# EAGLE design MotherboardV2.0.2 (EAGLE 7.2.0)

## Sheet 1 of 8: LATCHING CIRCUIT
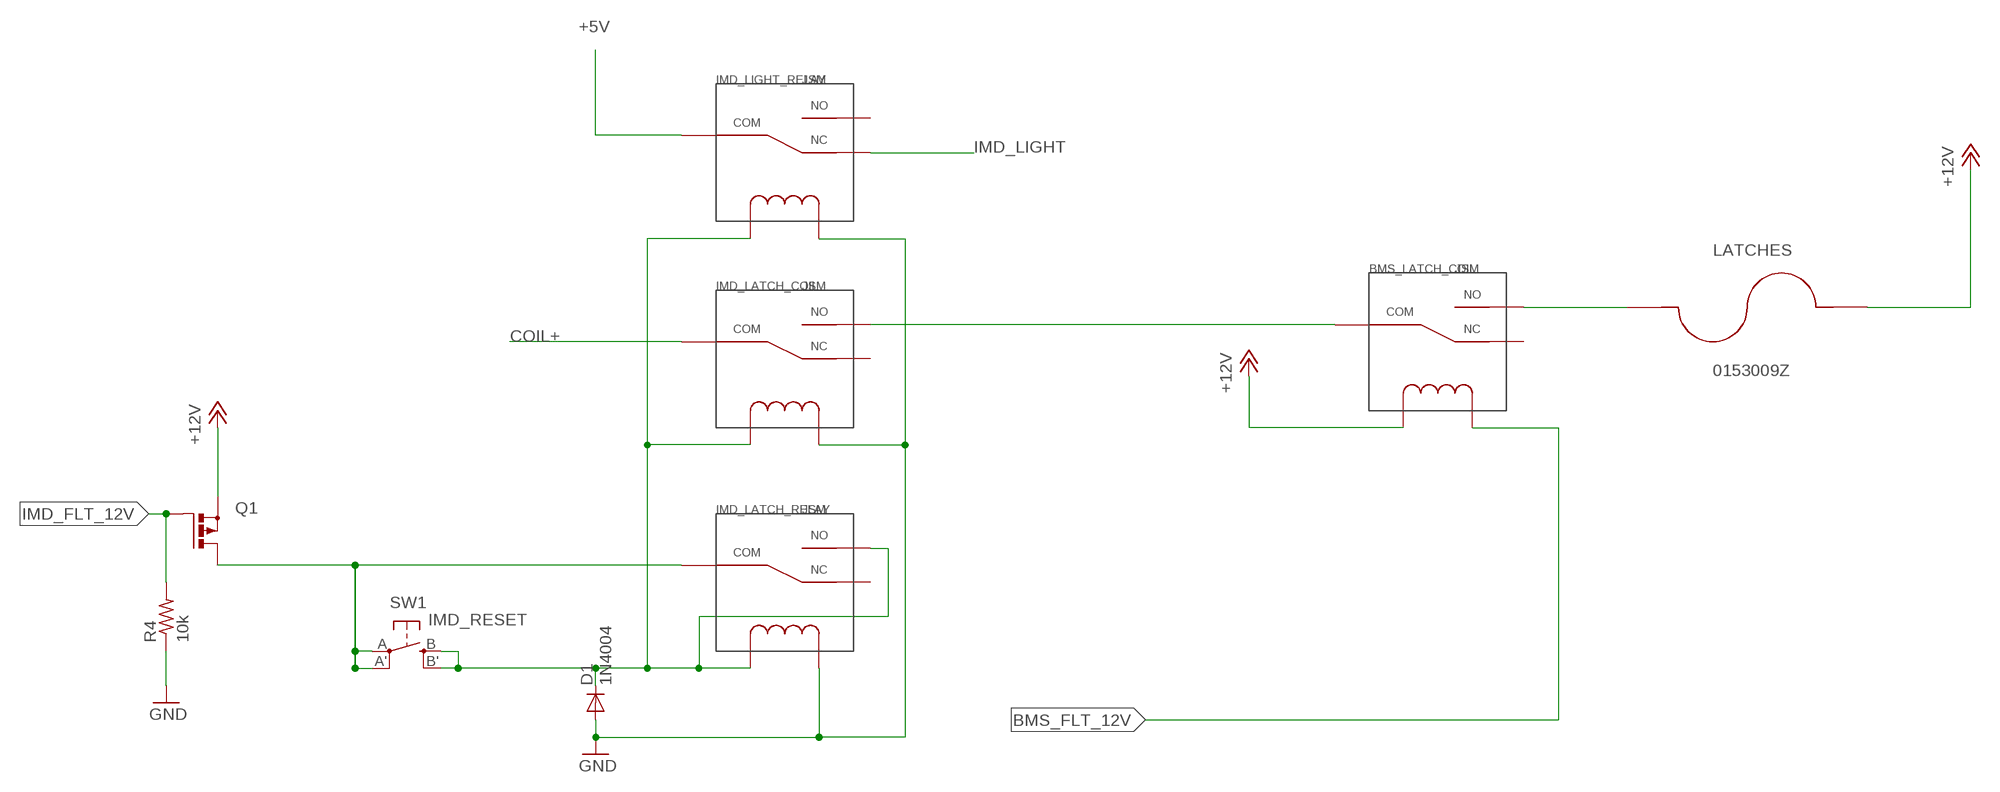
[diagram p0: schematic, sheet 1]

### Parts
BMS_LATCH_COIL  JSM  [JS-M]
D1  1N4004  [DO41-10]
IMD_LATCH_COIL  JSM  [JS-M]
IMD_LATCH_RELAY  JSM  [JS-M]
IMD_LIGHT_RELAY  JSM  [JS-M]
LATCHES  0153009Z  [MINIFUSEHOLDER]
Q1  PMOSFET_PTO220BV  [TO220BV]
R4  10k  R-US_0207/9  [0207/9]
SW1  IMD_RESET  SPST_TACT-EVQQ2  [EVQ-Q2]

### Nets
+5V: IMD_LIGHT_RELAY.COM ; also sheet 2,5,6,7
+12V: BMS_LATCH_COIL.COIL1 LATCHES.P$2 Q1.S ; also sheet 2,3,4,6,7
BMS_FLT_12V: BMS_LATCH_COIL.COIL2 ; also sheet 4,7
COIL+: IMD_LATCH_COIL.COM ; also sheet 2
GND: D1.A IMD_LATCH_COIL.COIL2 IMD_LATCH_RELAY.COIL2 IMD_LIGHT_RELAY.COIL2 R4.1 ; also sheet 2,3,4,5,6,7
IMD_FLT_12V: Q1.G R4.2 ; also sheet 2,7
IMD_LATCH_SW1: IMD_LATCH_RELAY.COM Q1.D SW1.A'(P1) SW1.A(P)
IMD_LATCH_SW2: D1.C IMD_LATCH_COIL.COIL1 IMD_LATCH_RELAY.COIL1 IMD_LATCH_RELAY.NO IMD_LIGHT_RELAY.COIL1 SW1.B'(S1) SW1.B(S)
IMD_LIGHT: IMD_LIGHT_RELAY.NC ; also sheet 2
N$11: BMS_LATCH_COIL.COM IMD_LATCH_COIL.NO
N$35: BMS_LATCH_COIL.NO LATCHES.P$1
Unconnected: BMS_LATCH_COIL.NC IMD_LATCH_COIL.NC IMD_LATCH_RELAY.NC IMD_LIGHT_RELAY.NO

## Sheet 2 of 8: CONNECTORS
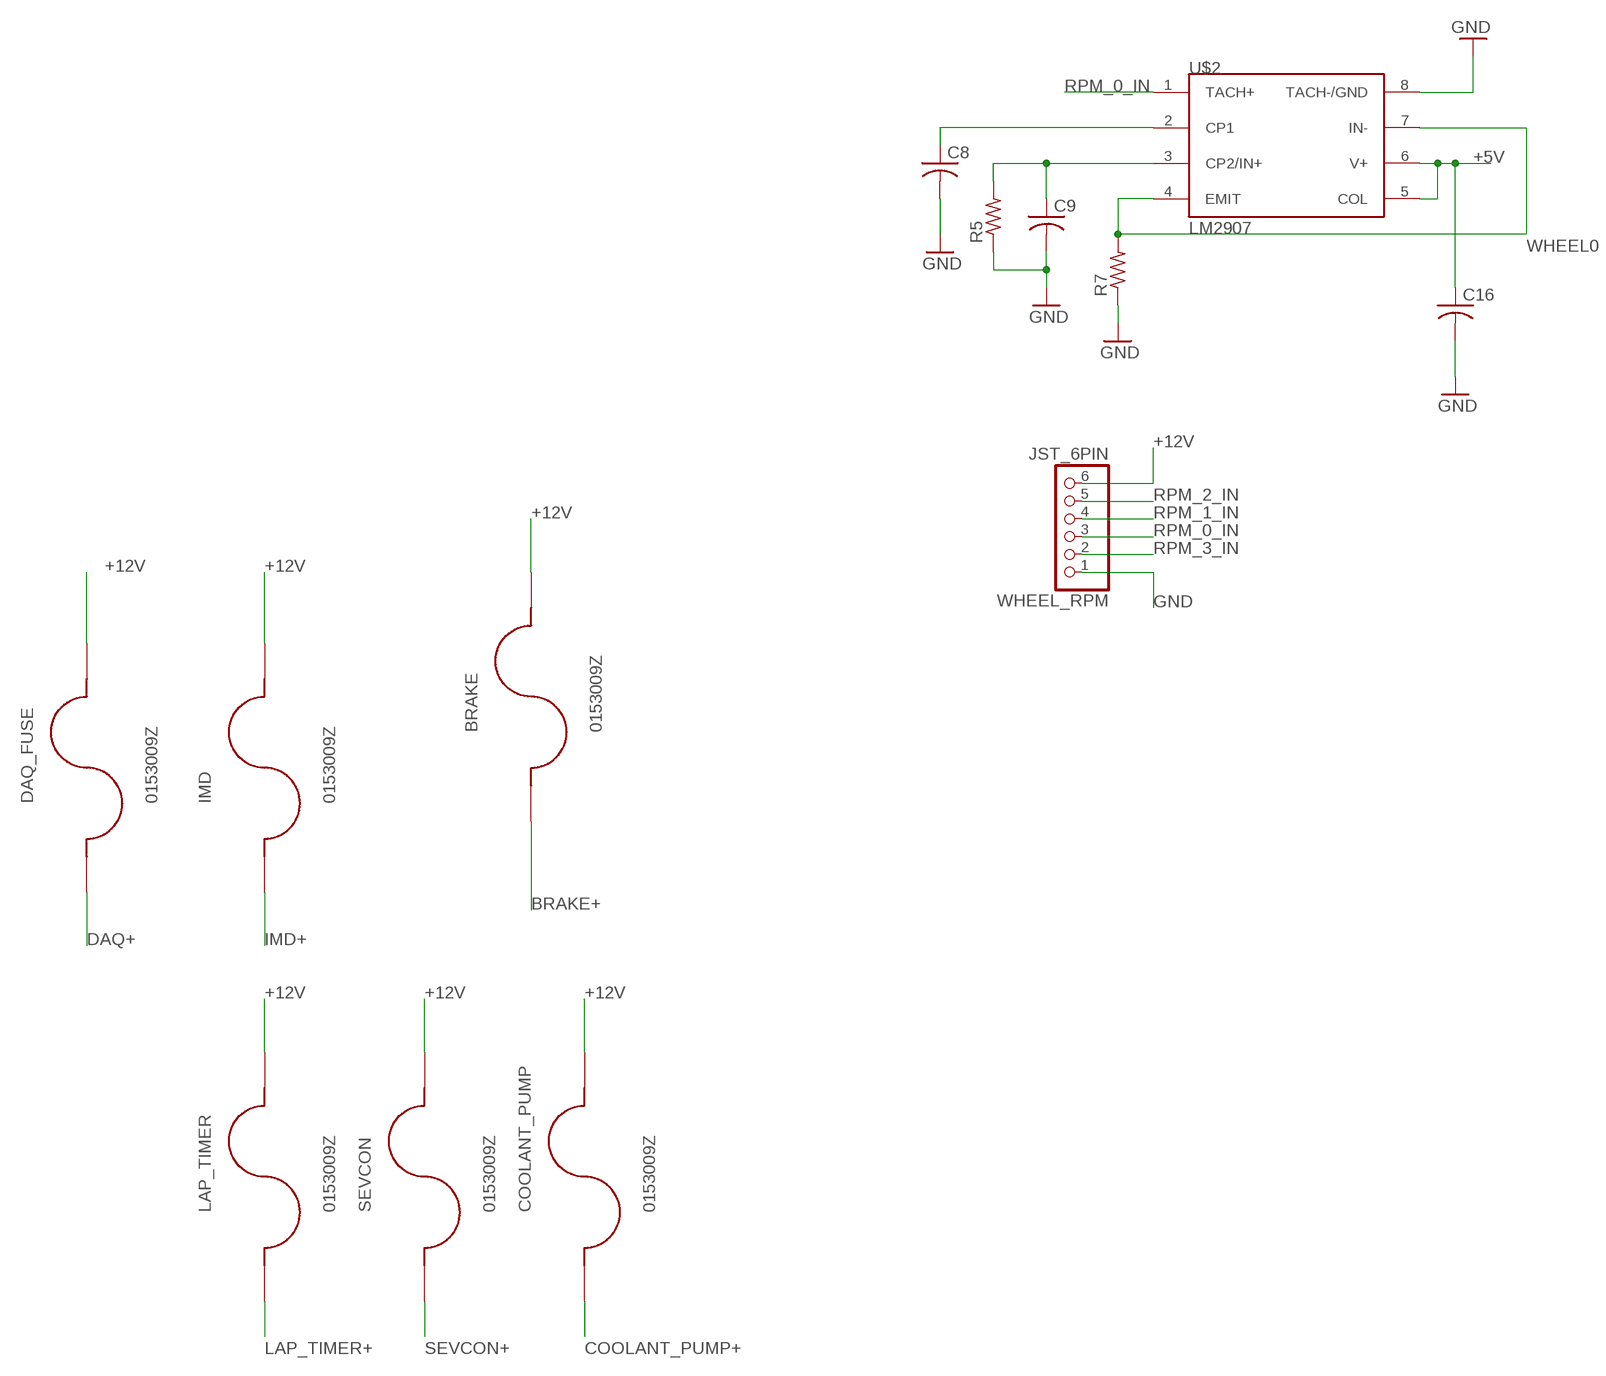
[diagram p1: schematic, sheet 2, part 1 of 2]
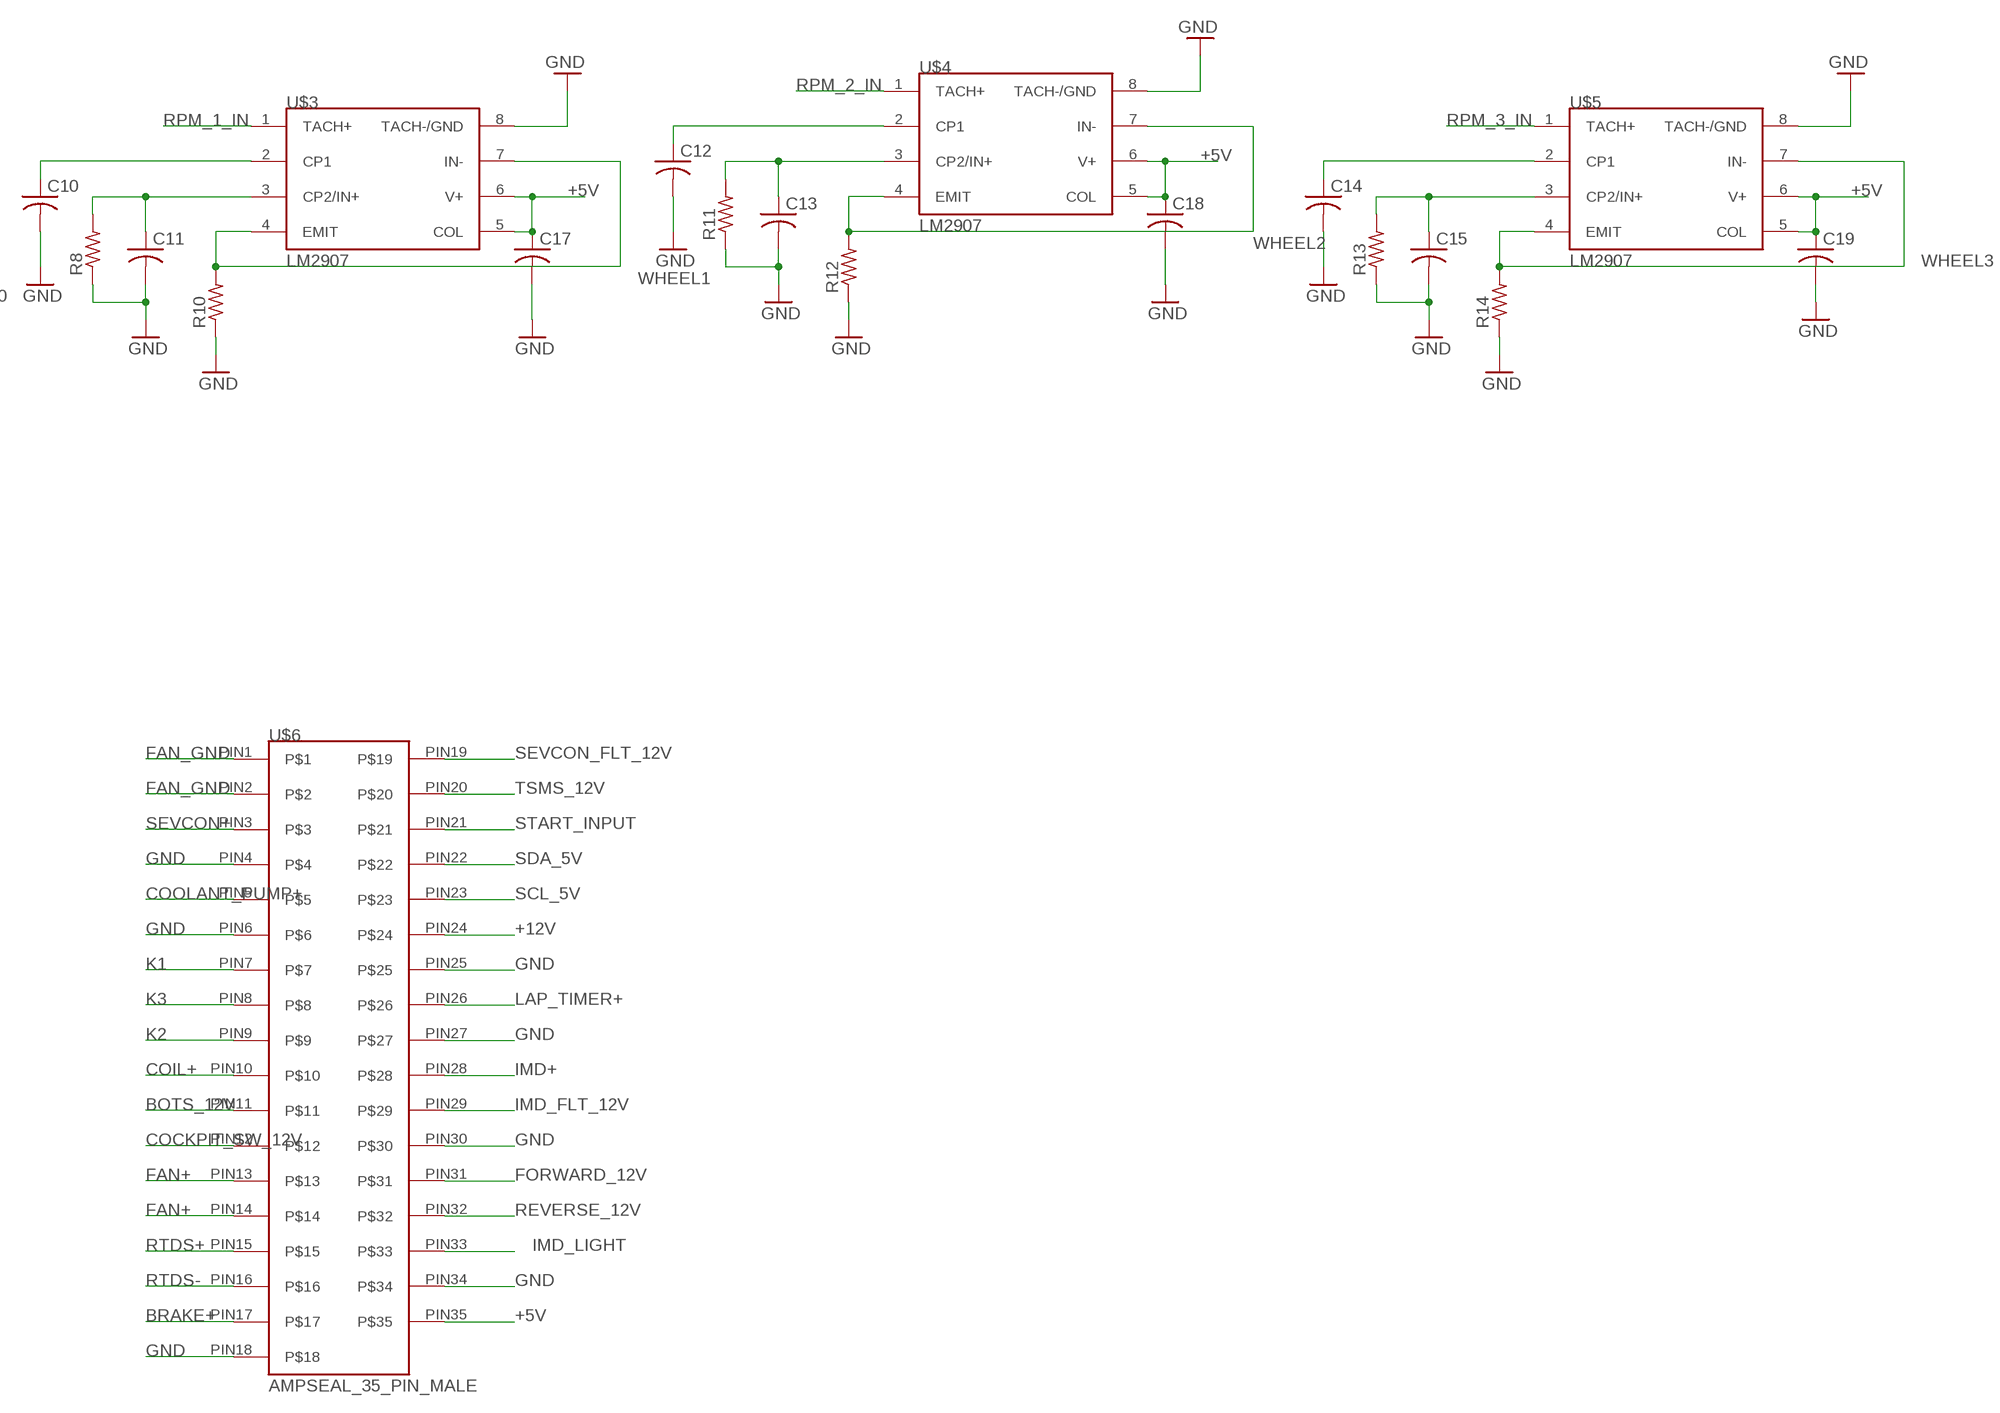
[diagram p2: schematic, sheet 2, part 2 of 2]

### Parts
BRAKE  0153009Z  [MINIFUSEHOLDER]
C8  C-US050-024X044  [C050-024X044]
C9  C-US050-024X044  [C050-024X044]
C10  C-US050-024X044  [C050-024X044]
C11  C-US050-024X044  [C050-024X044]
C12  C-US050-024X044  [C050-024X044]
C13  C-US050-024X044  [C050-024X044]
C14  C-US050-024X044  [C050-024X044]
C15  C-US050-024X044  [C050-024X044]
C16  C-US050-024X044  [C050-024X044]
C17  C-US050-024X044  [C050-024X044]
C18  C-US050-024X044  [C050-024X044]
C19  C-US050-024X044  [C050-024X044]
COOLANT_PUMP  0153009Z  [MINIFUSEHOLDER]
DAQ_FUSE  0153009Z  [MINIFUSEHOLDER]
IMD  0153009Z  [MINIFUSEHOLDER]
LAP_TIMER  0153009Z  [MINIFUSEHOLDER]
R5  R-US_0309/V  [0309V]
R7  R-US_0309/V  [0309V]
R8  R-US_0309/V  [0309V]
R10  R-US_0309/V  [0309V]
R11  R-US_0309/V  [0309V]
R12  R-US_0309/V  [0309V]
R13  R-US_0309/V  [0309V]
R14  R-US_0309/V  [0309V]
SEVCON  0153009Z  [MINIFUSEHOLDER]
U$2  LM2907  [DIL08]
U$3  LM2907  [DIL08]
U$4  LM2907  [DIL08]
U$5  LM2907  [DIL08]
U$6  AMPSEAL_35_PIN_MALE  [AMPSEAL_35_PIN_MALE]
WHEEL_RPM  JST_6PIN  [JST-PH-6-THM]

### Nets
+5V: C16.1 C17.1 C18.1 C19.1 U$2.5(COL) U$2.6(V+) U$3.5(COL) U$3.6(V+) U$4.5(COL) U$4.6(V+) U$5.5(COL) U$5.6(V+) U$6.PIN35 ; also sheet 1,5,6,7
+12V: BRAKE.P$2 COOLANT_PUMP.P$2 DAQ_FUSE.P$2 IMD.P$2 LAP_TIMER.P$2 SEVCON.P$2 U$6.PIN24 WHEEL_RPM.6 ; also sheet 1,3,4,6,7
BOTS_12V: U$6.PIN11 ; also sheet 7
BRAKE+: BRAKE.P$1 U$6.PIN17
COCKPIT_SW_12V: U$6.PIN12 ; also sheet 7
COIL+: U$6.PIN10 ; also sheet 1
COOLANT_PUMP+: COOLANT_PUMP.P$1 U$6.PIN5
DAQ+: DAQ_FUSE.P$1 ; also sheet 6
FAN+: U$6.PIN13 U$6.PIN14 ; also sheet 4
FAN_GND: U$6.PIN1 U$6.PIN2 ; also sheet 4
FORWARD_12V: U$6.PIN31 ; also sheet 7
GND: C8.2 C9.2 C10.2 C11.2 C12.2 C13.2 C14.2 C15.2 C16.2 C17.2 C18.2 C19.2 R5.1 R7.1 R8.1 R10.1 R11.1 R12.1 R13.1 R14.1 U$2.8(TACH-/GND) U$3.8(TACH-/GND) U$4.8(TACH-/GND) U$5.8(TACH-/GND) U$6.PIN4 U$6.PIN6 U$6.PIN18 U$6.PIN25 U$6.PIN27 U$6.PIN30 U$6.PIN34 WHEEL_RPM.1 ; also sheet 1,3,4,5,6,7
IMD+: IMD.P$1 U$6.PIN28
IMD_FLT_12V: U$6.PIN29 ; also sheet 1,7
IMD_LIGHT: U$6.PIN33 ; also sheet 1
K1: U$6.PIN7 ; also sheet 4
K2: U$6.PIN9 ; also sheet 4
K3: U$6.PIN8 ; also sheet 4
LAP_TIMER+: LAP_TIMER.P$1 U$6.PIN26
N$4: C8.1 U$2.2(CP1)
N$5: C9.1 R5.2 U$2.3(CP2/IN+)
N$8: C10.1 U$3.2(CP1)
N$9: C11.1 R8.2 U$3.3(CP2/IN+)
N$12: C12.1 U$4.2(CP1)
N$13: C13.1 R11.2 U$4.3(CP2/IN+)
N$15: C14.1 U$5.2(CP1)
N$16: C15.1 R13.2 U$5.3(CP2/IN+)
REVERSE_12V: U$6.PIN32 ; also sheet 7
RPM_0_IN: U$2.1(TACH+) WHEEL_RPM.3
RPM_1_IN: U$3.1(TACH+) WHEEL_RPM.4
RPM_2_IN: U$4.1(TACH+) WHEEL_RPM.5
RPM_3_IN: U$5.1(TACH+) WHEEL_RPM.2
RTDS+: U$6.PIN15 ; also sheet 3
RTDS-: U$6.PIN16 ; also sheet 3
SCL_5V: U$6.PIN23 ; also sheet 5
SDA_5V: U$6.PIN22 ; also sheet 5
SEVCON+: SEVCON.P$1 U$6.PIN3
SEVCON_FLT_12V: U$6.PIN19 ; also sheet 7
START_INPUT: U$6.PIN21 ; also sheet 5
TSMS_12V: U$6.PIN20 ; also sheet 7
WHEEL0: R7.2 U$2.4(EMIT) U$2.7(IN-) ; also sheet 5
WHEEL1: R10.2 U$3.4(EMIT) U$3.7(IN-) ; also sheet 5
WHEEL2: R12.2 U$4.4(EMIT) U$4.7(IN-) ; also sheet 5
WHEEL3: R14.2 U$5.4(EMIT) U$5.7(IN-) ; also sheet 5

## Sheet 3 of 8: OUTPUT RELAYS
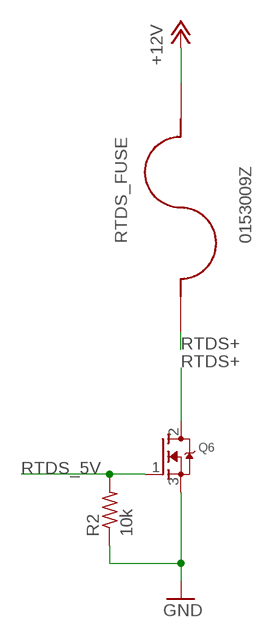
[diagram p3: schematic, sheet 3]

### Parts
Q6  MOSFET-NGDS_TO220V  [TO220V]
R2  10k  R-US_0207/9  [0207/9]
RTDS_FUSE  0153009Z  [MINIFUSEHOLDER]

### Nets
+12V: RTDS_FUSE.P$2 ; also sheet 1,2,4,6,7
GND: Q6.3(S) R2.1 ; also sheet 1,2,4,5,6,7
RTDS+: RTDS_FUSE.P$1 ; also sheet 2
RTDS-: Q6.2(D) ; also sheet 2
RTDS_5V: Q6.1(G) R2.2 ; also sheet 5

## Sheet 4 of 8: BMS CONNECTORS
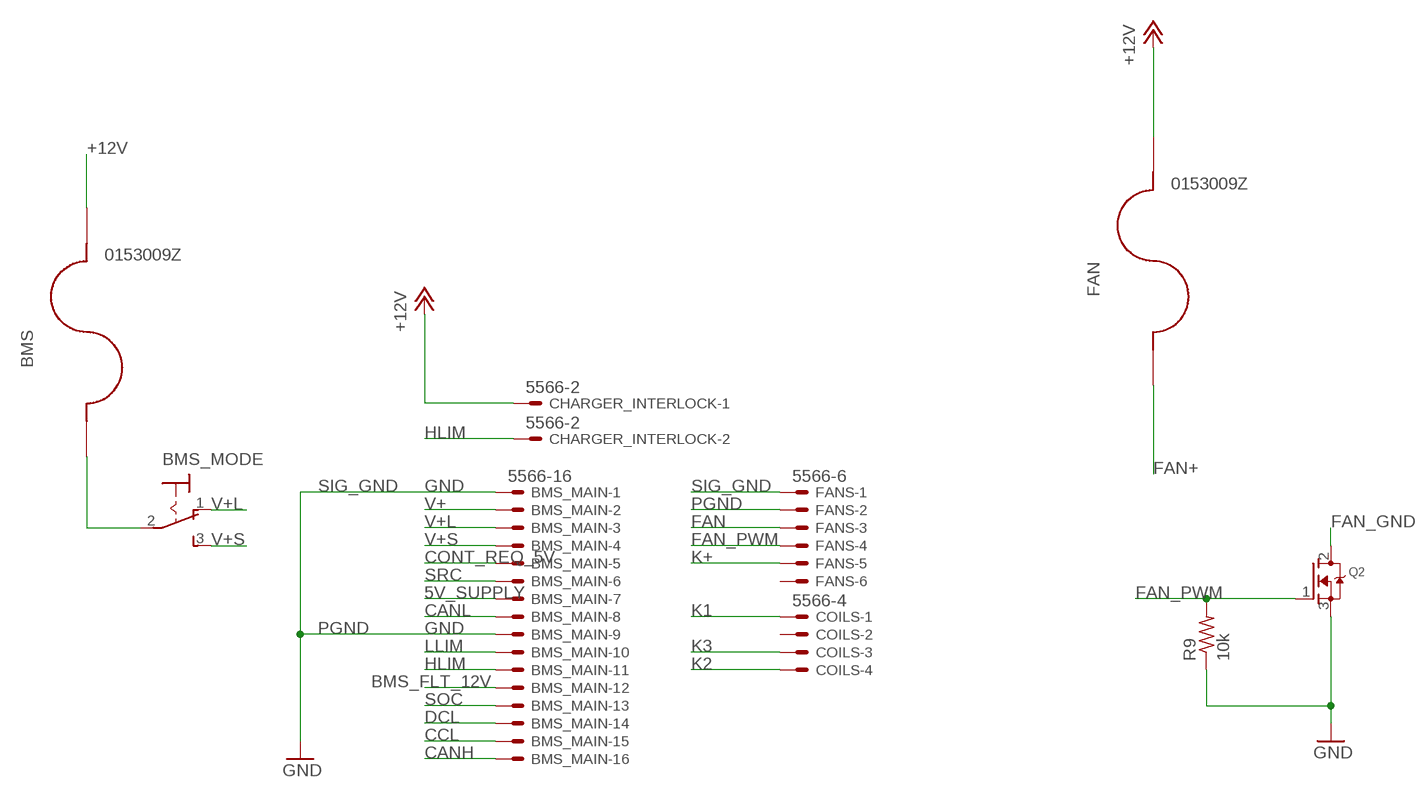
[diagram p4: schematic, sheet 4]

### Parts
BMS  0153009Z  [MINIFUSEHOLDER]
BMS_MAIN  5566-16  [5566-16]
BMS_MODE  320-916  [320-916]
CHARGER_INTERLOCK  5566-2  [5566-2]
COILS  5566-4  [5566-4]
FAN  0153009Z  [MINIFUSEHOLDER]
FANS  5566-6  [5566-6]
Q2  MOSFET-NGDS_TO220V  [TO220V]
R9  10k  R-US_0207/9  [0207/9]

### Nets
5V_SUPPLY: BMS_MAIN.7
+12V: BMS.P$2 CHARGER_INTERLOCK.1 FAN.P$2 ; also sheet 1,2,3,6,7
BMS_FLT_12V: BMS_MAIN.12 ; also sheet 1,7
CANH: BMS_MAIN.16
CANL: BMS_MAIN.8
CCL: BMS_MAIN.15
CONT_REQ_5V: BMS_MAIN.5 ; also sheet 5
DCL: BMS_MAIN.14
FAN: FANS.3
FAN+: FAN.P$1 ; also sheet 2
FAN_GND: Q2.2(D) ; also sheet 2
FAN_PWM: FANS.4 Q2.1(G) R9.2
GND: BMS_MAIN.1 BMS_MAIN.9 Q2.3(S) R9.1 ; also sheet 1,2,3,5,6,7
HLIM: BMS_MAIN.11 CHARGER_INTERLOCK.2
K1: COILS.1 ; also sheet 2
K2: COILS.4 ; also sheet 2
K3: COILS.3 ; also sheet 2
K+: FANS.5
LLIM: BMS_MAIN.10
N$3: BMS.P$1 BMS_MODE.2(P)
PGND: FANS.2
SIG_GND: FANS.1
SOC: BMS_MAIN.13 ; also sheet 5
SRC: BMS_MAIN.6
V+: BMS_MAIN.2
V+L: BMS_MAIN.3 BMS_MODE.1(O)
V+S: BMS_MAIN.4 BMS_MODE.3(S)
Unconnected: COILS.2 FANS.6

### Notes on the sheet
- SIG_GND
- PGND

## Sheet 5 of 8: VCU
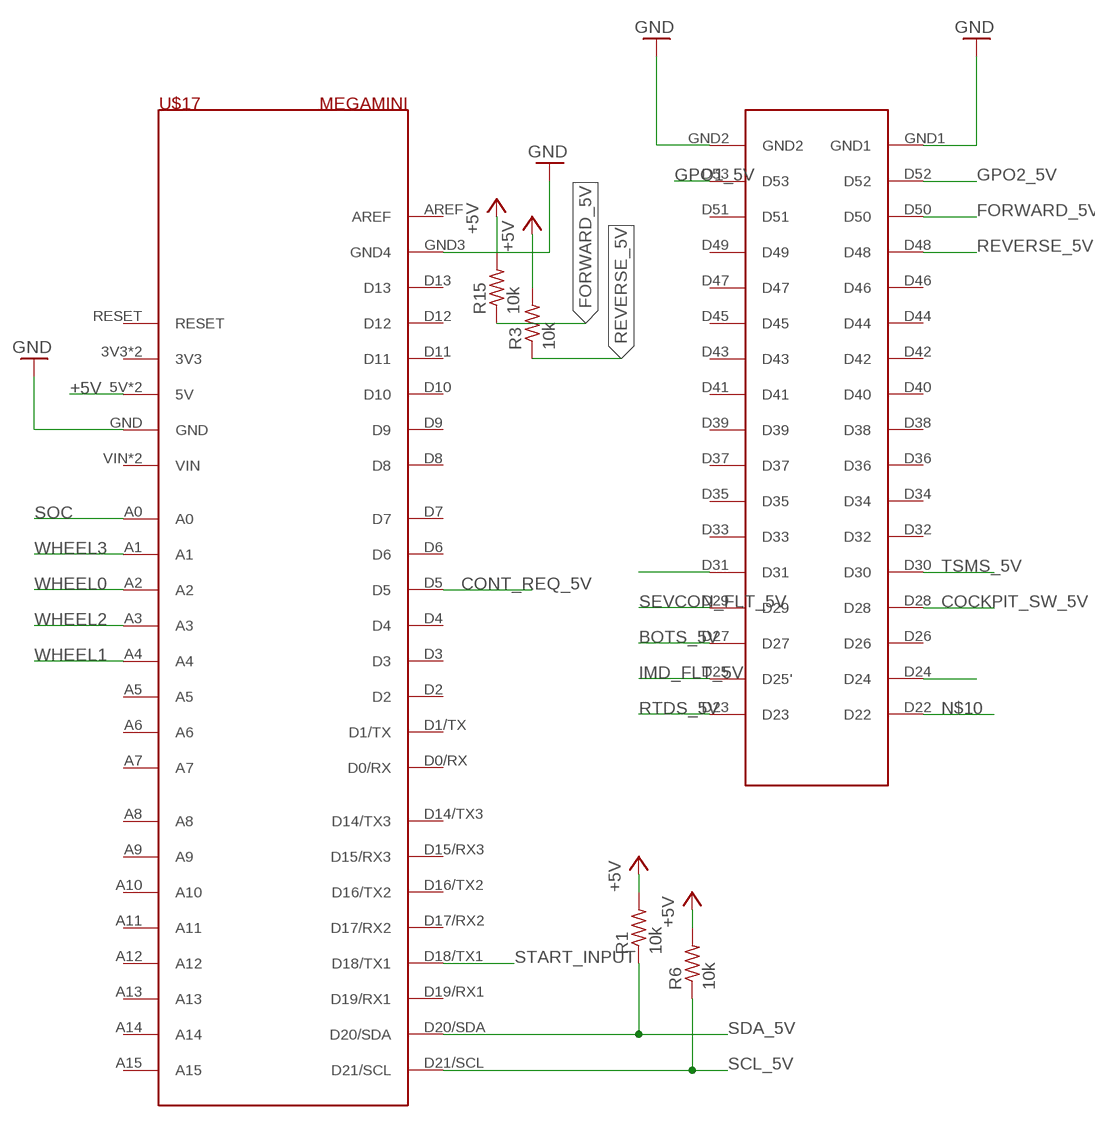
[diagram p5: schematic, sheet 5]

### Parts
R1  10k  R-US_0207/9  [0207/9]
R3  10k  R-US_0207/9  [0207/9]
R6  10k  R-US_0207/9  [0207/9]
R15  10k  R-US_0207/9  [0207/9]
U$17  MEGAMINI  [MEGAMINI]

### Nets
+5V: R1.2 R3.2 R6.2 R15.2 U$17.5V U$17.5V_2(5V) ; also sheet 1,2,6,7
BMS_FLT_5V: U$17.D31 ; also sheet 7
BOTS_5V: U$17.D27 ; also sheet 7
COCKPIT_SW_5V: U$17.D28 ; also sheet 7
CONT_REQ_5V: U$17.D5 ; also sheet 4
FORWARD_5V: R15.1 U$17.D50 ; also sheet 7
GND: U$17.GND U$17.GND1 U$17.GND2 U$17.GND3(GND4) ; also sheet 1,2,3,4,6,7
GPO1_5V: U$17.D53 ; also sheet 7
GPO2_5V: U$17.D52 ; also sheet 7
IMD_FLT_5V: U$17.D25(D25') ; also sheet 7
N$1: U$17.D24
N$10: U$17.D22
REVERSE_5V: R3.1 U$17.D48 ; also sheet 7
RTDS_5V: U$17.D23 ; also sheet 3
SCL_5V: R6.1 U$17.D21/SCL ; also sheet 2
SDA_5V: R1.1 U$17.D20/SDA ; also sheet 2
SEVCON_FLT_5V: U$17.D29 ; also sheet 7
SOC: U$17.A0 ; also sheet 4
START_INPUT: U$17.D18/TX1 ; also sheet 2
TSMS_5V: U$17.D30 ; also sheet 7
WHEEL0: U$17.A2 ; also sheet 2
WHEEL1: U$17.A4 ; also sheet 2
WHEEL2: U$17.A3 ; also sheet 2
WHEEL3: U$17.A1 ; also sheet 2
Unconnected: U$17.3V3 U$17.3V3_2(3V3) U$17.A5 U$17.A6 U$17.A7 U$17.A8 U$17.A9 U$17.A10 U$17.A11 U$17.A12 U$17.A13 U$17.A14 U$17.A15 U$17.AREF U$17.D0/RX U$17.D1/TX U$17.D2 U$17.D3 U$17.D4 U$17.D6 U$17.D7 U$17.D8 U$17.D9 U$17.D10 U$17.D11 U$17.D12 U$17.D13 U$17.D14/TX3 U$17.D15/RX3 U$17.D16/TX2 U$17.D17/RX2 U$17.D19/RX1 U$17.D26 U$17.D32 U$17.D33 U$17.D34 U$17.D35 U$17.D36 U$17.D37 U$17.D38 U$17.D39 U$17.D40 U$17.D41 U$17.D42 U$17.D43 U$17.D44 U$17.D45 U$17.D46 U$17.D47 U$17.D49 U$17.D51 U$17.RESET U$17.VIN U$17.VIN_2(VIN)

## Sheet 6 of 8: REGULATORS
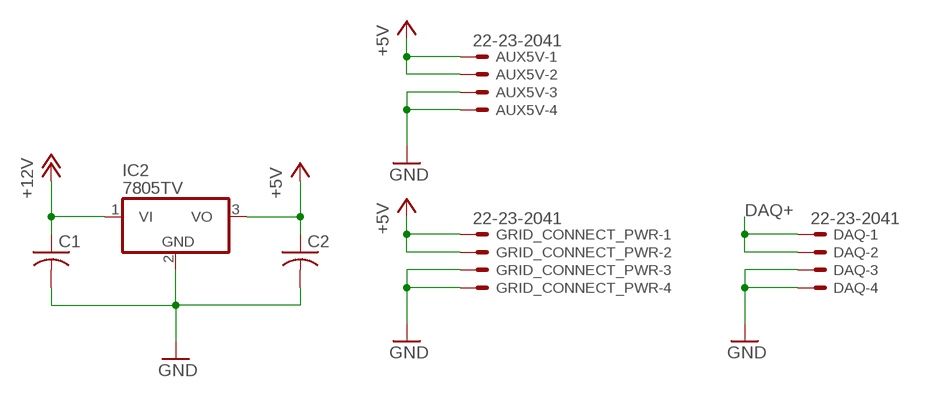
[diagram p6: schematic, sheet 6]

### Parts
AUX5V  22-23-2041  [22-23-2041]
C1  C-US050-024X044  [C050-024X044]
C2  C-US050-024X044  [C050-024X044]
DAQ  22-23-2041  [22-23-2041]
GRID_CONNECT_PWR  22-23-2041  [22-23-2041]
IC2  7805TV  [TO220V]

### Nets
+5V: AUX5V.1 AUX5V.2 C2.1 GRID_CONNECT_PWR.1 GRID_CONNECT_PWR.2 IC2.3(VO) ; also sheet 1,2,5,7
+12V: C1.1 IC2.1(VI) ; also sheet 1,2,3,4,7
DAQ+: DAQ.1 DAQ.2 ; also sheet 2
GND: AUX5V.3 AUX5V.4 C1.2 C2.2 DAQ.3 DAQ.4 GRID_CONNECT_PWR.3 GRID_CONNECT_PWR.4 IC2.2(GND) ; also sheet 1,2,3,4,5,7

## Sheet 7 of 8: LEVEL SHIFTING
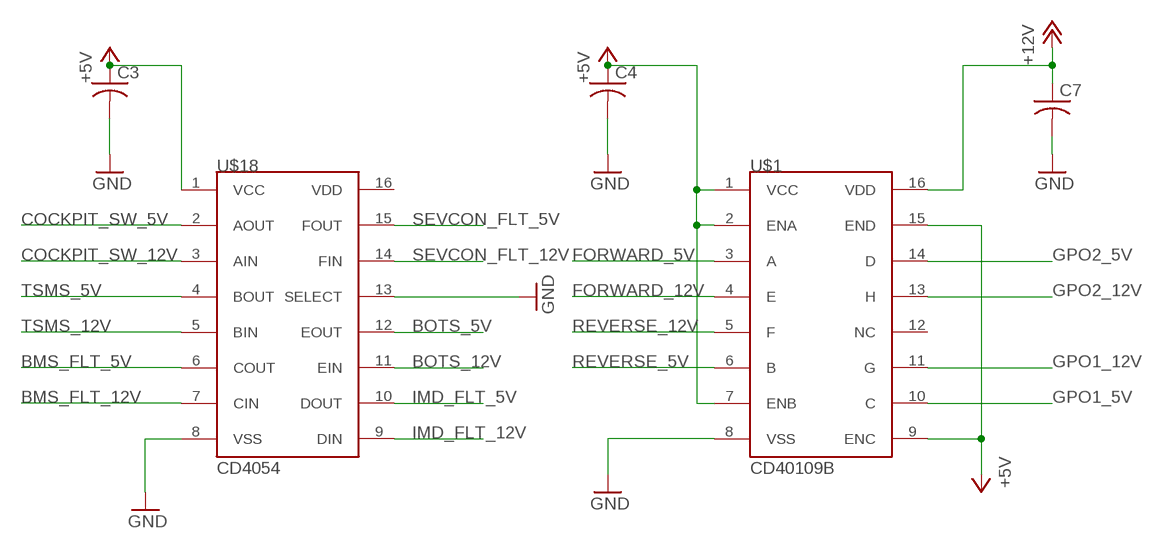
[diagram p7: schematic, sheet 7]

### Parts
C3  C-US050-024X044  [C050-024X044]
C4  C-US050-024X044  [C050-024X044]
C7  C-US050-024X044  [C050-024X044]
U$1  CD40109B  [DIL16]
U$18  CD4054  [DIL16]

### Nets
+5V: C3.1 C4.1 U$1.1(VCC) U$1.2(ENA) U$1.7(ENB) U$1.9(ENC) U$1.15(END) U$18.1(VCC) ; also sheet 1,2,5,6
+12V: C7.1 U$1.16(VDD) ; also sheet 1,2,3,4,6
BMS_FLT_5V: U$18.6(COUT) ; also sheet 5
BMS_FLT_12V: U$18.7(CIN) ; also sheet 1,4
BOTS_5V: U$18.12(EOUT) ; also sheet 5
BOTS_12V: U$18.11(EIN) ; also sheet 2
COCKPIT_SW_5V: U$18.2(AOUT) ; also sheet 5
COCKPIT_SW_12V: U$18.3(AIN) ; also sheet 2
FORWARD_5V: U$1.3(A) ; also sheet 5
FORWARD_12V: U$1.4(E) ; also sheet 2
GND: C3.2 C4.2 C7.2 U$1.8(VSS) U$18.8(VSS) U$18.13(SELECT) ; also sheet 1,2,3,4,5,6
GPO1_5V: U$1.10(C) ; also sheet 5
GPO1_12V: U$1.11(G)
GPO2_5V: U$1.14(D) ; also sheet 5
GPO2_12V: U$1.13(H)
IMD_FLT_5V: U$18.10(DOUT) ; also sheet 5
IMD_FLT_12V: U$18.9(DIN) ; also sheet 1,2
REVERSE_5V: U$1.6(B) ; also sheet 5
REVERSE_12V: U$1.5(F) ; also sheet 2
SEVCON_FLT_5V: U$18.15(FOUT) ; also sheet 5
SEVCON_FLT_12V: U$18.14(FIN) ; also sheet 2
TSMS_5V: U$18.4(BOUT) ; also sheet 5
TSMS_12V: U$18.5(BIN) ; also sheet 2
Unconnected: U$1.12(NC) U$18.16(VDD)

## Sheet 8 of 8

## Library data of the parts
AUX5V DAQ GRID_CONNECT_PWR = con-molex:22-23-2041: .100" (2.54mm) Center Header - 4 Pin; MF: MOLEX; MPN: 22-23-2041; OC_FARNELL: 1462920; OC_NEWARK: 38C0355
BMS BRAKE COOLANT_PUMP DAQ_FUSE FAN IMD LAP_TIMER LATCHES RTDS_FUSE SEVCON = littelfuse:0153009Z: http://www.digikey.com/product-search/en/circuit-protection/fuseholders/655422?k=01530009 MINI ATC, MINI ATO Blade fuse holder
BMS_LATCH_COIL IMD_LATCH_COIL IMD_LATCH_RELAY IMD_LIGHT_RELAY = panasonic:JSM
BMS_MAIN = con-molex:5566-16: Mini FIT connector 16 pol Source: http://www.molex.com; OC_FARNELL: unknown; OC_NEWARK: unknown
BMS_MODE = switch:320-916: TOGGLE SWITCH distributor RS Components
C1-C4 C7-C19 = adafruit:C-US: CAPACITOR, American symbol
CHARGER_INTERLOCK = con-molex:5566-2: Mini FIT connector 2 pol Source: http://www.molex.com; OC_FARNELL: 1822072; OC_NEWARK: unknown
COILS = con-molex:5566-4: Mini FIT connector 4 pol Source: http://www.molex.com; OC_FARNELL: unknown; OC_NEWARK: unknown
D1 = adafruit:1N4004: DIODE General purpose 1N400x type rectifier (With bigger pads) http://www.ladyada.net/library/pcb/eaglelibrary.html
FANS = con-molex:5566-6: Mini FIT connector 6 pol Source: http://www.molex.com; MPN: 95566-61002; OC_FARNELL: unknown; OC_NEWARK: 22K8620
IC2 = linear:78*: Positive VOLTAGE REGULATOR Source: http://cache.national.com/ds/LM/LM78L05.pdf http://www.fairchildsemi.com/ds/LM/LM7805.pdf
Q1 = transistor-power:PMOSFET_P: Power MOSFET P-Channel
Q2 Q6 = adafruit:MOSFET-N: N-Channel Mosfet 2N7002E - 60V 260mA SOT23 [Digikey: 2N7002ET1GOSTR-ND] - REEL BSH103 - 30V 850mA SOT23 [Digikey: 568-5013-1-ND]
R1-R15 = adafruit:R-US_: RESISTOR, American symbol
SW1 = adafruit:SPST_TACT: SMT 6mm switch, EVQQ2 series http://www.ladyada.net/library/eagle
U$1 = texas:CD40109B
U$2-U$5 = texas:LM2907
U$6 = AMPSEAL 35 PIN MALE:AMPSEAL_35_PIN_MALE
U$17 = Mega-mini:MEGAMINI
U$18 = texas:CD4054
WHEEL_RPM = adafruit:JST_6PIN

## Board
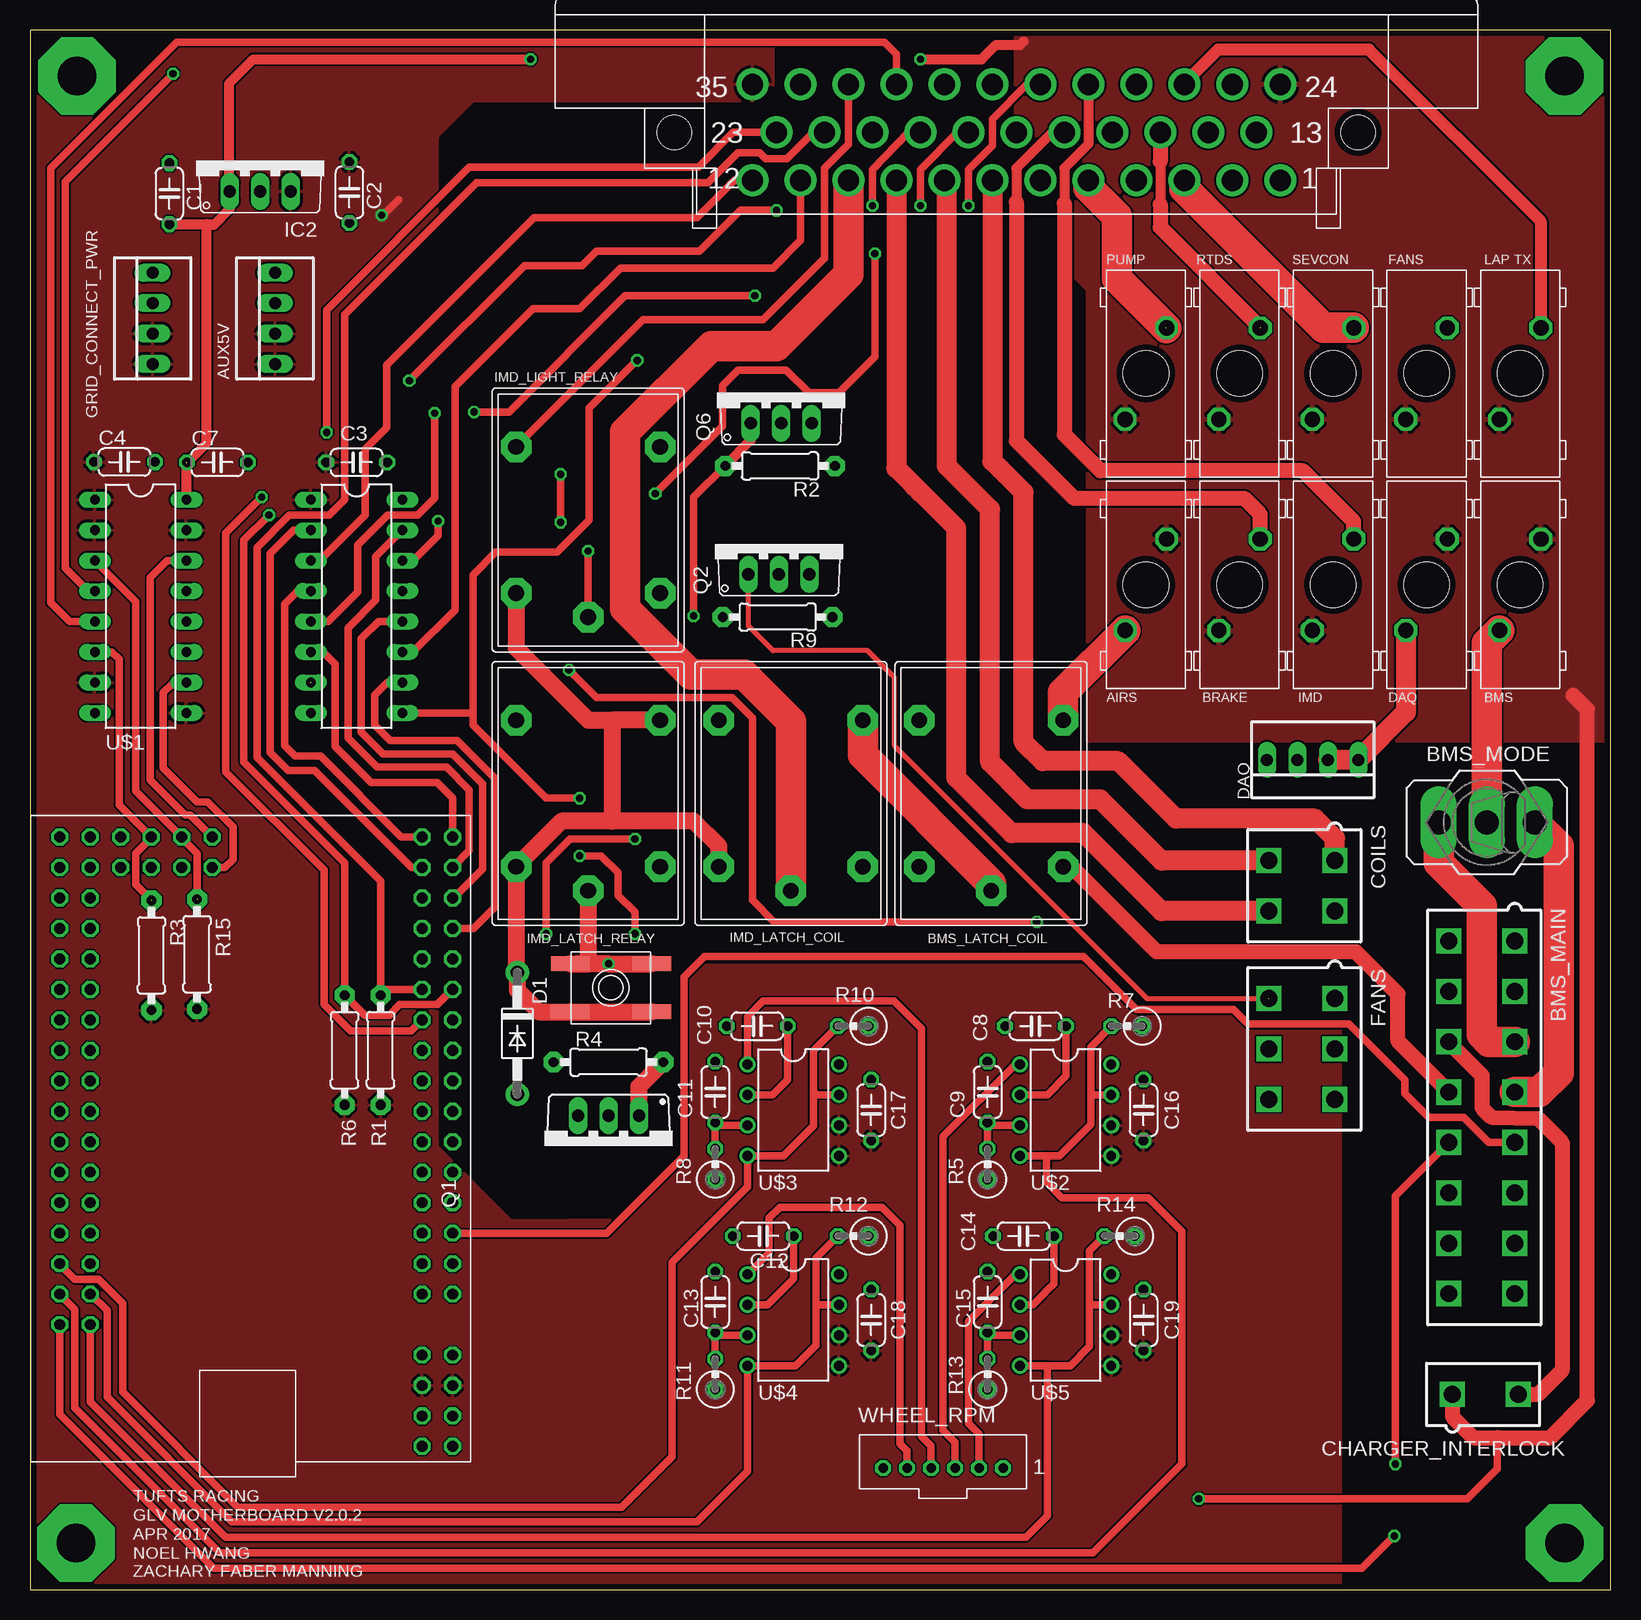
[diagram p8: board, top side]
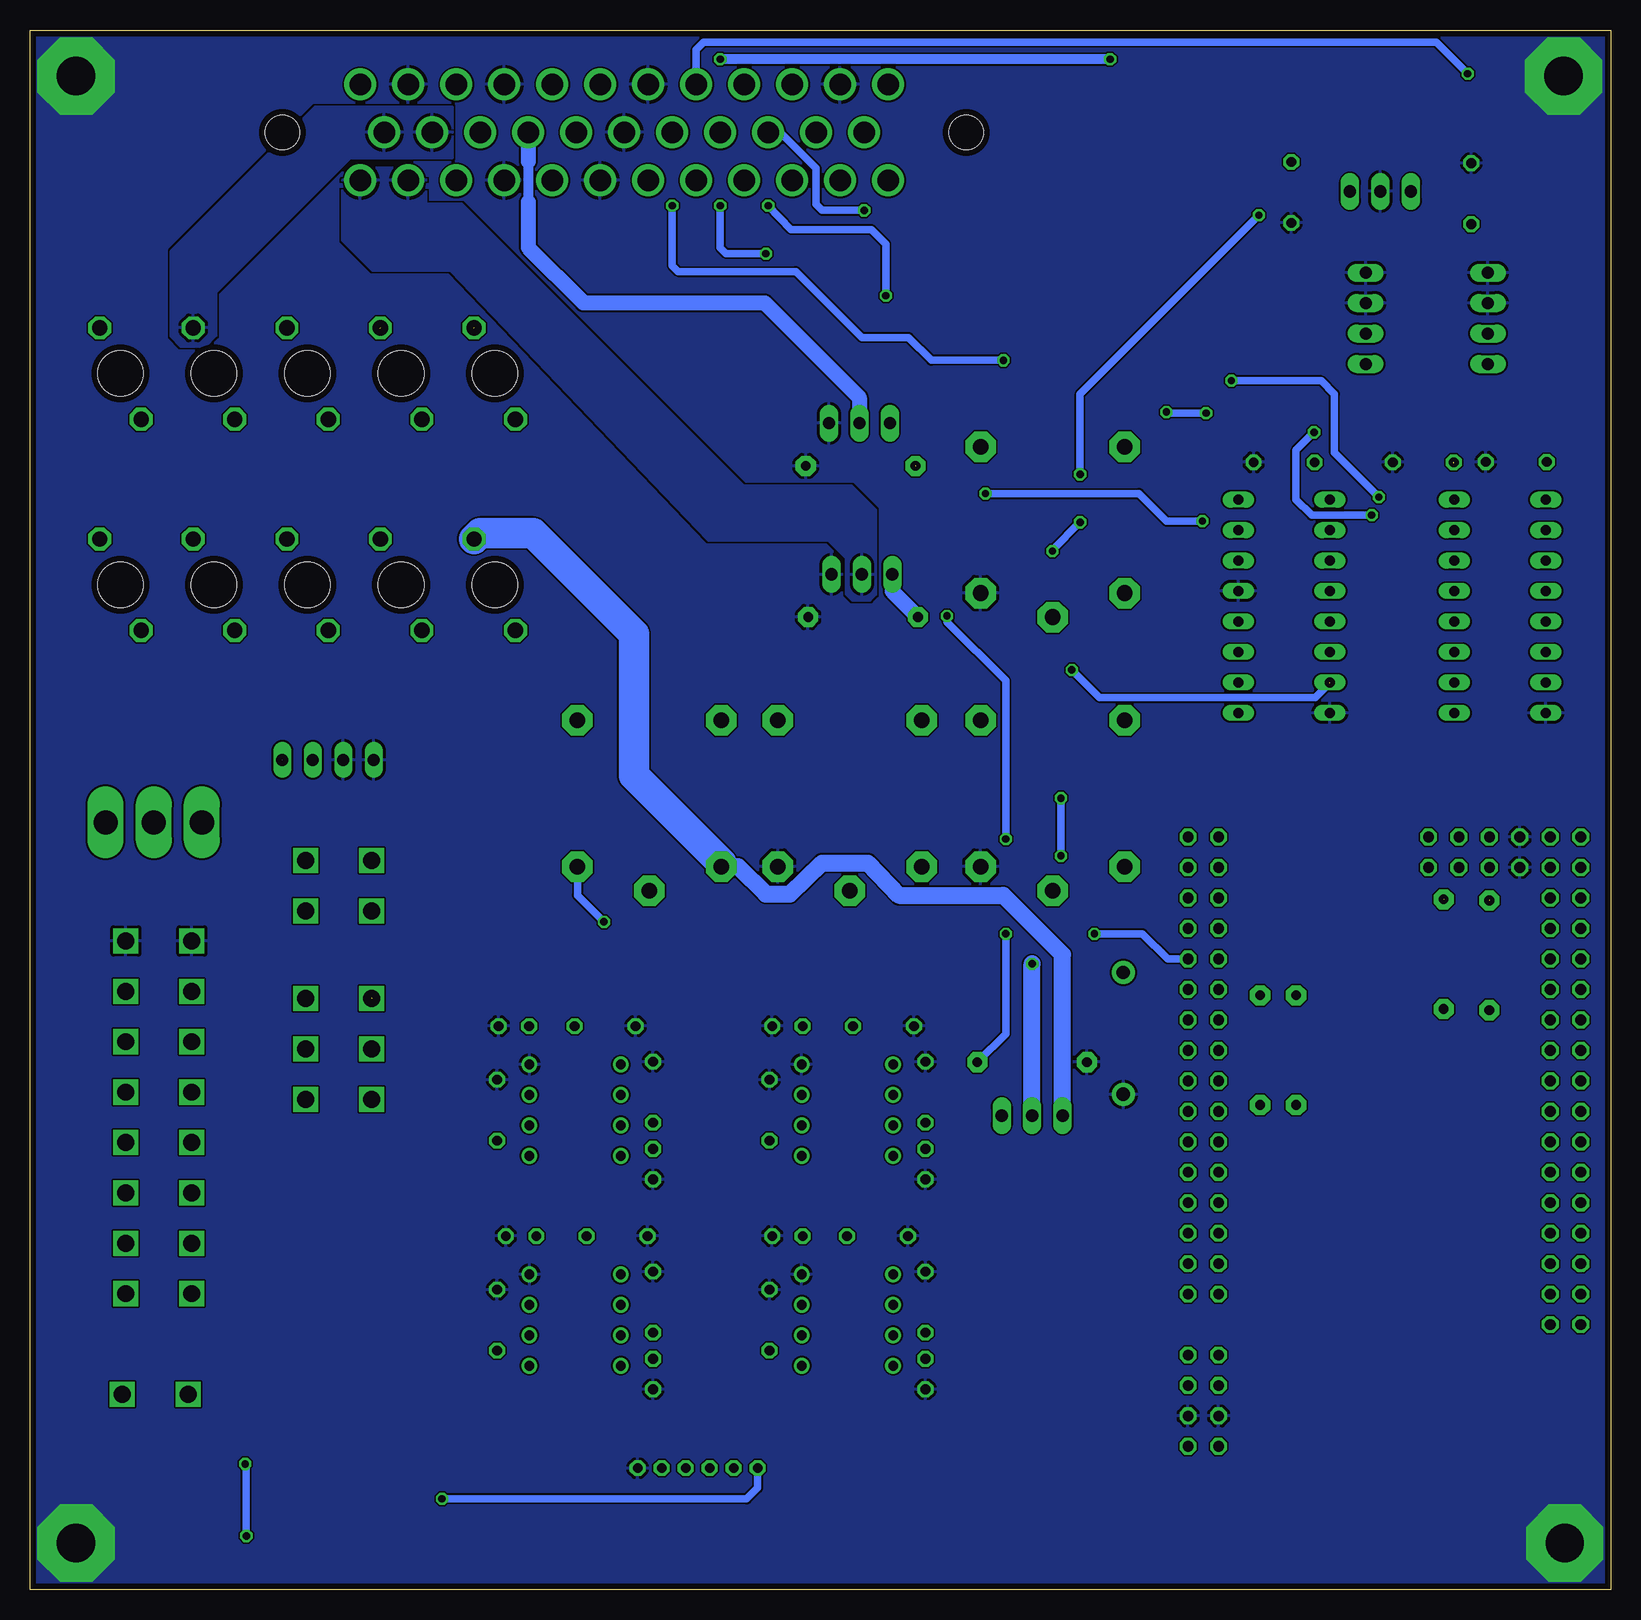
[diagram p9: board, bottom side, seen from below]

Size 131.76 x 130.04 mm. Coordinates in mm from the lower left corner, seen from the top.
Outline: 0,0 131.76,0 131.76,130.04 0,130.04 0,0
Copper layers (1*16): Top 0.035mm / dielectric 1.5mm / Bottom 0.035mm
Design rules "3pcb": minimum track width 6mil, minimum drill 8mil, track to track 6mil, track to pad 6mil, pad to pad 6mil, via to via 6mil, smd to smd 6mil, copper to edge 20mil, drill to drill 6mil, minimum pad ring 10mil, minimum via ring 8mil, stop-mask expansion 4mil, vias tented up to drill 0mil, thermal gap 10mil

### Footprints (pad centres in the part's own frame; a part is rotated, then mirrored left to right if it is on the bottom)
22-23-2041 = drill 1 long: 1 -3.81,0; 2 -1.27,0; 3 1.27,0; 4 3.81,0
MINIFUSEHOLDER = drill 1.27 octagon: P$1 1.727,3.81; P$2 -1.727,-3.81 | hole 3.785: 0,0
JS-M = drill 1.3 pad 2.54 octagon: COIL1 -6.1,6; COIL2 -6.1,-6; COM -8.1,0; NC 6.1,6; NO 6.1,-6
5566-16 = drill 1.4 square: 1 14.7,-2.75; 2 10.5,-2.75; 3 6.3,-2.75; 4 2.1,-2.75; 5 -2.1,-2.75; 6 -6.3,-2.75; 7 -10.5,-2.75; 8 -14.7,-2.75; 9 14.7,2.75; 10 10.5,2.75; 11 6.3,2.75; 12 2.1,2.75; 13 -2.1,2.75; 14 -6.3,2.75; 15 -10.5,2.75; 16 -14.7,2.75
320-916 = drill 2.007 long: 1 0,4.013; 2 0,0; 3 0,-4.013
C050-024X044 = drill 0.813 octagon: 1 -2.54,0; 2 2.54,0
5566-2 = drill 1.4 square: 1 0,-2.75; 2 0,2.75
5566-4 = drill 1.4 square: 1 2.1,-2.75; 2 -2.1,-2.75; 3 2.1,2.75; 4 -2.1,2.75
DO41-10 = drill 1.118 pad 1.93: A 5.08,0; C -5.08,0
5566-6 = drill 1.4 square: 1 4.2,-2.75; 2 0,-2.75; 3 -4.2,-2.75; 4 4.2,2.75; 5 0,2.75; 6 -4.2,2.75
TO220V = drill 1.016 long: 1 -2.54,-2.54; 2 0,-2.54; 3 2.54,-2.54
TO220BV = drill 1.016 long: D 0,-2.54; G -2.54,-2.54; S 2.54,-2.54
0207/9 = drill 0.813 pad 1.676 octagon: 1 -4.572,0; 2 4.572,0
0309V = drill 0.813 octagon: 1 -1.27,0; 2 1.27,0
EVQ-Q2 = smd 3.2 x 1.2: A -3.4,-2; A' 3.4,-2; B -3.4,2; B' 3.4,2
DIL16 = drill 0.813 long: 1 -8.89,-3.81; 2 -6.35,-3.81; 3 -3.81,-3.81; 4 -1.27,-3.81; 5 1.27,-3.81; 6 3.81,-3.81; 7 6.35,-3.81; 8 8.89,-3.81; 9 8.89,3.81; 10 6.35,3.81; 11 3.81,3.81; 12 1.27,3.81; 13 -1.27,3.81; 14 -3.81,3.81; 15 -6.35,3.81; 16 -8.89,3.81
DIL08 = drill 0.813 pad 1.27: 1 -3.81,-3.81; 2 -1.27,-3.81; 3 1.27,-3.81; 4 3.81,-3.81; 5 3.81,3.81; 6 1.27,3.81; 7 -1.27,3.81; 8 -3.81,3.81
AMPSEAL_35_PIN_MALE = drill 1.778 pad 2.54: PIN1 -22,4; PIN2 -18,4; PIN3 -14,4; PIN4 -10,4; PIN5 -6,4; PIN6 -2,4; PIN7 2,4; PIN8 6,4; PIN9 10,4; PIN10 14,4; PIN11 18,4; PIN12 22,4; PIN13 -20,0; PIN14 -16,0; PIN15 -12,0; PIN16 -8,0; PIN17 -4,0; PIN18 0,0; PIN19 4,0; PIN20 8,0; PIN21 12,0; PIN22 16,0; PIN23 20,0; PIN24 -22,-4; PIN25 -18,-4; PIN26 -14,-4; PIN27 -10,-4; PIN28 -6,-4; PIN29 -2,-4; PIN30 2,-4; PIN31 6,-4; PIN32 10,-4; PIN33 14,-4; PIN34 18,-4; PIN35 22,-4 | hole 2.85: -28.5,0; 28.5,0
MEGAMINI = drill 0.9 octagon: 3V3 8.89,1.524; 3V3_2 8.89,4.064; 5V 6.35,1.524; 5V_2 6.35,4.064; A0 11.43,34.264; A1 11.43,31.724; A2 13.97,34.264; A3 13.97,31.724; A4 16.51,34.264; A5 16.51,31.724; A6 19.05,34.264; A7 19.05,31.724; A8 21.59,34.264; A9 21.59,31.724; A10 24.13,34.264; A11 24.13,31.724; A12 26.67,34.264; A13 26.67,31.724; A14 29.21,34.264; A15 29.21,31.724; AREF 31.75,34.264; D0/RX 13.97,4.064; D1/TX 13.97,1.524; D2 16.51,4.064; D3 16.51,1.524; D4 19.05,4.064; D5 19.05,1.524; D6 21.59,4.064; D7 21.59,1.524; D8 24.13,4.064; D9 24.13,1.524; D10 26.67,4.064; D11 26.67,1.524; D12 29.21,4.064; D13 29.21,1.524; D14/TX3 31.75,4.064; D15/RX3 31.75,1.524; D16/TX2 34.29,4.064; D17/RX2 34.29,1.524; D18/TX1 36.83,4.064; D19/RX1 36.83,1.524; D20/SDA 39.37,4.064; D21/SCL 39.37,1.524; D22 41.91,4.064; D23 41.91,1.524; D24 44.45,4.064; D25 44.45,1.524; D26 46.99,4.064; D27 46.99,1.524; D28 49.53,4.064; D29 49.53,1.524; D30 52.07,4.064; D31 52.07,1.524; D32 34.29,34.264; D33 34.29,31.724; D34 36.83,34.264; D35 36.83,31.724; D36 39.37,34.264; D37 39.37,31.724; D38 41.91,34.264; D39 41.91,31.724; D40 44.45,34.264; D41 44.45,31.724; D42 46.99,34.264; D43 46.99,31.724; D44 49.53,34.264; D45 49.53,31.724; D46 52.07,34.264; D47 52.07,31.724; D48 52.07,26.644; D49 49.53,26.644; D50 52.07,24.104; D51 49.53,24.104; D52 52.07,21.564; D53 49.53,21.564; GND 49.53,29.184; GND1 52.07,29.184; GND2 3.81,4.064; GND3 3.81,1.524; RESET 31.75,31.724; VIN 1.27,1.524; VIN_2 1.27,4.064
JST-PH-6-THM = drill 0.8 octagon: 1 7,0; 2 5,0; 3 3,0; 4 1,0; 5 -1,0; 6 -3,0

### Placement (x,y rotation side)
AUX5V  20.42,106 90 top
BMS  124.22,83.8 180 top
BMS_LATCH_COIL  80.12,66.4 90 top
BMS_MAIN  121.02,39.4 90 top
BMS_MODE  121.44,63.99 90 top
BRAKE  100.82,83.8 0 top
C1  11.62,116.4 90 top
C2  26.62,116.5 270 top
C3  27.22,94 0 top
C4  7.87,94.03 0 top
C7  15.62,94 0 top
C8  83.82,47 180 top
C9  79.82,41.5 90 top
C10  60.62,47 180 top
C11  57.12,41.5 90 top
C12  61.12,29.5 180 top
C13  57.12,24 90 top
C14  82.82,29.5 180 top
C15  79.82,24 90 top
C16  92.82,40 90 top
C17  70.12,40 90 top
C18  70.12,22.5 90 top
C19  92.82,22.5 90 top
CHARGER_INTERLOCK  121.32,16.3 270 top
COILS  106.02,58.7 90 top
COOLANT_PUMP  93.02,101.4 0 top
D1  40.62,46.4 270 top
DAQ  106.92,69.2 180 top
DAQ_FUSE  116.42,83.8 180 top
FAN  116.42,101.4 0 top
FANS  106.02,45.1 90 top
GRID_CONNECT_PWR  10.22,106 90 top
IC2  19.19,119.12 0 top
IMD  108.62,83.8 0 top
IMD_LATCH_COIL  63.42,66.4 90 top
IMD_LATCH_RELAY  46.52,66.4 90 top
IMD_LIGHT_RELAY  46.52,89.2 90 top
LAP_TIMER  124.22,101.4 0 top
LATCHES  93.02,83.8 180 top
Q1  48.22,37 180 top
Q2  62.42,87.2 0 top
Q6  62.62,99.8 0 top
R1  29.22,45 270 top
R2  62.52,93.7 180 top
R3  10.12,52.9 270 top
R4  48.22,44 0 top
R5  79.82,35.5 90 top
R6  26.22,45 270 top
R7  91.42,47 180 top
R8  57.12,35.5 90 top
R9  62.32,81.1 180 top
R10  68.62,47 180 top
R11  57.12,18 90 top
R12  68.62,29.5 180 top
R13  79.82,18 90 top
R14  90.82,29.5 180 top
R15  13.92,53 270 top
RTDS_FUSE  100.82,101.4 0 top
SEVCON  108.62,101.4 0 top
SW1  48.42,50.2 180 top
U$1  9.22,82 270 top
U$2  86.32,40 270 top
U$3  63.62,40 270 top
U$4  63.62,22.5 270 top
U$5  86.32,22.5 270 top
U$6  82.22,121.5 180 top
U$17  36.75,10.7 90 top
U$18  27.22,82 270 top
WHEEL_RPM  74.11,10.15 0 top

### Tracks (layer width: path | path; a pad name or v marks a point on that pad's centre or on a via)
+5V  (via drill 0.6)
  Top 0.61: IMD_LIGHT_RELAY.COM v46.52,86.6 | v44.22,89 v44.22,93 | v29.32,114.6 29.42,114.6 30.72,115.9
  Bottom 0.61: v46.52,86.6 46.52,86.7 v44.22,89 | v44.22,93 44.22,99.7 v29.32,114.6
  pour Top: -0.98,131 61.92,131 61.92,125.4 60.62,124.1 36.92,124.1 33.92,121.1 33.92,37 40.12,30.8 49.62,30.9 54.42,35.7 54.52,47.6 54.52,52.1 109.32,52.1 109.22,50.3 109.22,-2.6 -0.78,-2.8 -0.58,130.2 -0.98,130.2
+12V  (via drill 0.6)  (2 unrouted)
  Top 0.61: v97.42,7.6 119.82,7.6 122.32,10.1 122.32,12.7
  Top 0.813: C1.1 14.72,113.86 | 14.72,113.86 15.38,113.86 | 15.38,113.86 16.62,115.1 | 16.62,115.1 16.65,115.13 IC2.1 | U$1.16 13.06,90.94 13.06,93.94 14.72,95.6 14.72,113.8 | 14.72,113.8 14.72,113.86 | 14.72,113.8 15.32,113.8 15.38,113.86 | 16.62,115.1 16.62,125.6 18.62,127.6 v41.72,127.6 | v74.22,127.6 79.32,127.6 80.52,128.8 82.52,128.8 82.82,129.1
  Top 1.27: CHARGER_INTERLOCK.1 118.57,14.45 120.32,12.7 122.32,12.7 126.72,12.7 129.82,15.8 129.82,73.4 128.62,74.6
  Bottom 0.61: WHEEL_RPM.6 71.11,8.51 72.02,7.6 v97.42,7.6
  Bottom 0.813: v41.72,127.6 v74.22,127.6
  Bottom 1.422: BMS_LATCH_COIL.COIL1 72.72,60.3 70.42,58 68.42,58 65.72,60.6 61.92,60.6 59.32,57.9 50.62,57.9 45.68,52.96 Q1.S
  Bottom 2.54: BMS_LATCH_COIL.COIL1 74.12,60.6 81.42,67.9 81.42,79.7 89.82,88.1 94.26,88.1 LATCHES.P$2
  pour Top: 131.82,130.6 131.82,70.8 88.22,70.8 88.22,108.4 82.22,114.4 82.22,130.6
BMS_FLT_5V
  Top 0.61: U$18.6 24.43,78.19 25.42,77.2 25.42,70.3 28.42,67.3 33.92,67.3 35.22,66 U$17.D31
BMS_FLT_12V  (via drill 0.6)  (1 unrouted)
  Top 0.61: v83.92,55.7 62.02,55.7 60.22,57.5 60.22,72.7 58.52,74.4 47.22,74.4 v44.92,76.7
  Top 1.27: BMS_MAIN.12 114.02,45.75 114.02,49.7 110.52,53.2 93.92,53.2 86.82,60.3 BMS_LATCH_COIL.COIL2
  Bottom 0.61: BMS_LATCH_COIL.COIL2 86.12,57.9 v83.92,55.7 | v44.92,76.7 42.62,74.4 24.62,74.4 23.42,75.6
BOTS_5V
  Top 0.61: U$17.D27 35.31,57.69 37.72,60.1 37.72,67.2 35.22,69.7 29.42,69.7 27.62,71.5 27.62,79.3 29.05,80.73 U$18.12
BOTS_12V
  Top 0.61: U$18.11 31.91,78.19 35.42,81.7 35.42,100.3 41.92,106.8 45.82,106.8 49.22,110.2 61.92,110.2 64.22,112.5 U$6.PIN11
BRAKE+
  Top 0.813: U$6.PIN17 85.22,121.5 82.22,118.5 82.22,115.7
  Top 1.27: BRAKE.P$1 102.55,89.67 101.22,91 87.02,91 82.22,95.8 82.22,115.7
COCKPIT_SW_5V
  Top 0.61: U$17.D28 31.8,60.23 23.72,68.3 21.52,68.3 20.02,69.8 20.02,86.4 21.97,88.35 U$18.2
COCKPIT_SW_12V
  Top 0.61: U$18.3 24.13,85.81 27.92,89.6 27.92,95.1 29.72,96.9 29.72,102.1 42.02,114.4 55.62,114.4 58.72,117.5 U$6.PIN12
COIL+
  Top 2.54: IMD_LATCH_COIL.COM 63.42,72.4 59.52,76.3 55.12,76.3 49.62,81.8 49.62,96.5 56.82,103.7 62.22,103.7 68.22,109.7 U$6.PIN10
CONT_REQ_5V
  Top 0.61: BMS_MAIN.5 121.62,37.3 119.52,39.4 116.62,39.4 114.62,41.4 114.62,42.5 109.92,47.2 101.52,47.2 100.32,48.4 92.22,48.4 87.82,52.8 56.22,52.8 54.52,51.1 54.52,36.2 48.07,29.75 U$17.D5
COOLANT_PUMP+  (1 unrouted)
  Top 2.54: U$6.PIN5 88.22,116.9 90.62,114.5 90.62,109.3 94.72,105.2
DAQ+  (1 unrouted)
  Top 1.676: DAQ_FUSE.P$1 114.7,73.17 DAQ.1 | DAQ.1 DAQ.2
FAN+
  pour Bottom: 96.52,123.6 108.02,123.6 120.02,111.6 120.02,104.5 119.22,103.7 117.12,103.7 116.22,104.6 116.22,108.2 105.02,119.4 96.52,119.4
FAN_GND
  pour Bottom: 98.72,118.5 104.72,118.5 105.72,117.5 105.72,112.5 103.22,110 96.72,110 75.22,87.5 65.22,87.5 63.72,86 63.72,83 63.22,82.5 61.72,82.5 61.22,83 61.22,90 63.22,92 72.22,92 95.72,115.5 98.72,115.5
FAN_PWM  (1 unrouted)
  Top 0.406: Q2.1 59.88,80.34 61.92,78.3 69.82,78.3 72.02,76.1 72.02,70.4 93.12,49.3 103.22,49.3
  Bottom 1.27: Q2.1 59.88,83.23 R9.2
FORWARD_5V  (1 unrouted)
  Top 0.61: U$1.3 8.82,82.4 8.82,66.6 U$17.D50 12.64,62.68 13.92,61.4 13.92,57.6
FORWARD_12V  (via drill 0.6)
  Top 0.61: v11.92,126.4 2.92,117.4 2.92,85.2 4.85,83.27 U$1.4
  Bottom 0.61: v11.92,126.4 14.52,129 75.62,129 76.22,128.4 U$6.PIN31
GND  (via drill 3.2 pad 6.45)
  other vias: 3.92,126.2 127.92,126.2 3.82,3.9 127.92,3.9
  pour Bottom (rank 2): -11.28,136 -11.28,-13 145.22,-13 145.22,136
GPO1_5V
  Top 0.61: U$1.10 12.98,75.6 11.92,75.6 11.12,74.8 11.12,68.5 13.92,65.7 14.82,65.7 16.92,63.6 16.92,60.9 16.25,60.23 U$17.D53
GPO2_5V
  Top 0.61: 15.18,63.14 U$17.D52 | 15.42,63 U$17.D52 | U$1.14 11.43,85.81 10.02,84.4 10.02,67.5 12.92,64.6 13.35,64.6 U$17.D52
HLIM
  Top 1.27: BMS_MAIN.11 118.27,45.65 121.02,42.9 121.02,40.2 121.82,39.4 125.72,39.3 127.72,37.3 127.72,18.3 125.72,16.3 CHARGER_INTERLOCK.2
IMD+
  Top 0.813: U$6.PIN28 88.22,120.5 86.22,118.5 86.22,115.6
  Top 1.27: IMD.P$1 110.35,89.07 106.12,93.3 89.22,93.3 86.22,96.3 86.22,115.6
IMD_FLT_5V
  Top 0.61: U$18.10 29.77,75.65 28.72,74.6 28.72,72.1 30.02,70.8 35.62,70.8 38.72,67.7 38.72,56.9 36.97,55.15 U$17.D25
IMD_FLT_12V  (via drill 0.6)
  Top 0.61: U$18.9 36.91,73.11 36.92,73.1 | v50.42,54.7 50.42,56.5 49.02,57.9 49.02,59.8 47.62,61.2 v45.82,61.2 | v45.82,66 43.02,66 36.92,72.1 36.92,73.1 | 36.92,73.1 36.92,84.6 38.82,86.5 43.92,86.5 46.62,89.2 46.62,98.5 v50.62,102.5 | U$6.PIN29 83.12,125.5 80.22,122.6 80.22,120.4 78.22,118.4 v78.22,115.4
  Top 1.422: Q1.G 50.76,41.97 R4.2
  Bottom 0.61: R4.2 50.42,46.37 v50.42,54.7 | v45.82,61.2 v45.82,66 | v50.62,102.5 56.62,102.5 58.52,104.4 62.42,104.4 67.92,109.9 77.72,109.9 78.22,110.4 v78.22,115.4
IMD_LATCH_SW1  (via drill 0.6)
  Top 1.422: SW1.A' 45.62,52.2 46.62,52.2 | SW1.A v48.22,52.2 46.62,52.2 | IMD_LATCH_RELAY.COM 46.52,52.3 46.62,52.2
  Bottom 1.422: Q1.D v48.22,52.2
IMD_LATCH_SW2
  Top 1.422: SW1.B SW1.B' 42.42,48.2 40.62,50 D1.C 40.52,51.58 IMD_LATCH_RELAY.COIL1 44.32,64.1 48.52,64.1 | IMD_LATCH_COIL.COIL1 57.42,62 55.32,64.1 48.52,64.1 | IMD_LIGHT_RELAY.COIL1 40.52,78.5 46.52,72.5 48.52,72.5 | IMD_LATCH_RELAY.NO 48.52,72.5 | 48.52,72.5 48.52,64.1
IMD_LIGHT
  Top 0.61: IMD_LIGHT_RELAY.NC 51.12,105.9 61.12,105.9 66.22,111 66.22,118.5 68.22,120.5 U$6.PIN33
K1
  Top 1.676: COILS.1 108.77,62.65 107.12,64.3 95.52,64.3 90.72,69.1 84.42,69.1 82.82,70.7 82.82,91.5 81.32,93 80.92,93.4 80.22,94.1 U$6.PIN7
K2
  Top 1.676: COILS.4 94.32,56.6 87.82,63.1 81.82,63.1 77.22,67.7 77.22,88.5 74.22,91.5 73.72,92 72.22,93.5 U$6.PIN9
K3
  Top 1.676: COILS.3 94.32,60.8 89.22,65.9 83.12,65.9 80.02,69 80.02,90.1 76.42,93.7 76.42,117.3 arc90 U$6.PIN8
LAP_TIMER+
  Top 1.016: LAP_TIMER.P$1 125.92,105.24 125.92,114.1 111.62,128.4 99.02,128.4 96.22,125.6 U$6.PIN26
N$3
  Top 2.54: BMS_MODE.2 121.44,78.94 BMS.P$1
N$4
  Top 0.61: U$2.2 84.79,41.27 86.36,42.84 C8.1
N$5
  Top 0.61: R5.2 C9.1 79.82,38.73 U$2.3
N$8
  Top 0.61: U$3.2 61.89,41.27 63.16,42.54 C10.1
N$9
  Top 0.61: R8.2 C11.1 57.12,38.73 U$3.3
N$11
  Top 2.54: IMD_LATCH_COIL.NO 69.42,69.6 80.12,58.9 BMS_LATCH_COIL.COM
N$12
  Top 0.61: U$4.2 61.49,23.77 63.66,25.94 C12.1
N$13
  Top 0.61: R11.2 C13.1 57.12,21.23 U$4.3
N$15
  Top 0.61: U$5.2 83.59,23.77 84.47,24.65 84.82,25 85.36,25.54 C14.1
N$16
  Top 0.61: R13.2 C15.1 79.82,21.23 U$5.3
N$35
  Top 2.54: LATCHES.P$1 86.12,74.82 BMS_LATCH_COIL.NO
REVERSE_5V  (1 unrouted)
  Top 0.61: U$1.6 6.82,78.2 7.42,77.6 7.42,65.45 U$17.D48 10.1,62.68 8.82,61.4 8.82,58.8 10.12,57.5
REVERSE_12V
  Top 0.61: U$1.5 3.29,80.73 1.72,82.3 1.72,118.5 12.22,129 71.22,129 72.22,128 U$6.PIN32
RPM_0_IN
  Top 0.61: U$2.1 82.13,43.81 76.12,37.8 76.12,13.3 77.12,12.3 77.12,10.17 WHEEL_RPM.3
RPM_1_IN
  Top 0.61: U$3.1 59.81,47.79 61.12,49.1 72.02,49.1 74.32,46.8 74.32,12.8 75.12,12 75.12,10.17 WHEEL_RPM.4
RPM_2_IN
  Top 0.61: U$4.1 61.62,28.12 61.62,31 62.52,31.9 71.02,31.9 72.52,30.4 72.52,12.2 73.12,11.6 73.12,10.17 WHEEL_RPM.5
RPM_3_IN
  Top 0.61: U$5.1 82.13,26.31 78.22,22.4 78.22,13.9 79.12,13 79.12,10.17 WHEEL_RPM.2
RTDS+  (1 unrouted)
  Top 0.813: 94.22,119.1 94.22,115.5
  Top 1.27: U$6.PIN15 94.22,119.1 | 94.22,115.5 94.22,113.6 102.62,105.2
RTDS-
  Bottom 0.813: 90.22,119.1 90.22,115.7
  Bottom 1.27: U$6.PIN16 90.22,119.1 | 90.22,115.7 90.22,111.9 85.62,107.3 70.52,107.3 62.62,99.4 Q6.2
RTDS_5V  (via drill 0.6)  (1 unrouted)
  Top 0.61: v43.02,54.7 43.02,60.6 45.02,62.6 v50.42,62.6 | v55.32,81.2 55.32,91.1 57.92,93.7
  Top 0.813: Q6.1 60.08,95.83 R2.2
  Bottom 0.61: U$17.D23 36.93,52.6 39.02,54.7 v43.02,54.7 | v50.42,62.6 50.42,75.8 55.32,80.7 v55.32,81.2
SCL_5V  (via drill 0.6)
  Top 0.61: 33.92,48.8 35.19,50.06 U$17.D21/SCL 33.96,48.8 33.92,48.8 | 33.92,48.8 30.82,48.8 29.92,47.9 27.92,47.9 | 27.92,47.9 27.89,47.9 R6.1 26.22,60.6 17.82,69 17.82,87.5 v19.92,89.6 | 27.92,47.9 26.22,49.6 26.22,50.1 | v24.72,96.5 24.72,106.7 36.62,118.6 55.72,118.6 58.62,121.5 U$6.PIN23
  Bottom 0.61: v19.92,89.6 24.92,89.6 26.22,90.9 26.22,95 v24.72,96.5
SDA_5V
  Top 0.61: 29.76,50.06 29.22,50.06 R1.1 | U$17.D20/SDA 29.76,50.06 | 29.76,50.06 29.22,50.1 29.22,59.1 18.92,69.4 18.92,86.9 21.62,89.6 24.92,89.6 26.22,90.9 26.22,106.3 37.22,117.3 56.52,117.3 59.02,119.8 60.82,119.8 61.32,119.3 63.12,119.3 65.32,121.5 U$6.PIN22
SEVCON+
  Top 2.54: U$6.PIN3 96.22,116.8 107.81,105.21 SEVCON.P$1
SEVCON_FLT_5V
  Top 0.61: U$17.D29 36.62,61.62 36.62,66.7 34.72,68.6 28.92,68.6 26.52,71 26.52,80.2 28.82,82.5 28.82,86.14 U$18.15
SEVCON_FLT_12V  (via drill 0.6)
  Top 0.61: U$18.14 31.93,85.81 34.02,87.9 v34.02,89.1 | v52.12,91.4 57.72,97 57.72,100.4 59.02,101.7 63.02,101.7 64.92,99.8 67.42,99.8 70.42,102.8 v70.42,111.4 | U$6.PIN19 77.32,121.5 74.22,118.4 v74.22,115.4
  Bottom 0.61: v52.12,91.4 39.32,91.4 37.02,89.1 v34.02,89.1 | v74.22,115.4 74.22,111.9 73.72,111.4 v70.42,111.4
SOC  (via drill 0.6)
  Top 0.61: v113.72,4.5 111.02,1.8 15.32,1.8 2.48,14.64 U$17.A0 | v113.82,10.5 113.82,32.85 BMS_MAIN.13
  Bottom 0.61: v113.72,4.5 113.72,10.4 v113.82,10.5
START_INPUT  (via drill 0.6)
  Top 0.61: U$17.D18/TX1 31.76,46.6 26.72,46.6 24.52,48.8 24.52,60 16.32,68.2 16.32,88.1 v19.32,91.1 | v31.62,100.8 41.22,110.4 46.02,110.4 47.22,111.6 55.82,111.6 56.72,112.5 56.97,112.75 59.22,115 v62.22,115
  Bottom 0.61: v19.32,91.1 23.02,94.8 23.02,99.7 24.12,100.8 v31.62,100.8 | U$6.PIN21 69.22,121.5 66.22,118.5 66.22,115.5 65.72,115 v62.22,115
TSMS_5V
  Top 0.61: U$17.D30 30.96,62.77 24.22,69.5 22.12,69.5 21.22,70.4 21.22,82.2 22.29,83.27 U$18.4
TSMS_12V  (via drill 0.6)
  Top 0.61: U$18.5 24.85,80.73 27.32,83.2 27.32,87.1 29.82,89.6 32.32,89.6 33.72,91 v33.72,98.1 | v37.02,98.2 39.92,98.2 49.62,107.9 v60.42,107.9 | U$6.PIN20 73.22,121.5 70.22,118.4 v70.22,115.4
  Bottom 0.61: v33.72,98.1 36.92,98.1 v37.02,98.2 | v60.42,107.9 60.42,112.2 61.62,113.4 68.32,113.4 v70.22,115.4
V+L
  Top 2.54: BMS_MODE.1 117.43,60.59 121.02,57 121.02,46.3 121.62,45.7 BMS_MAIN.3
V+S
  Top 2.54: BMS_MAIN.4 125.82,41.5 127.42,43.1 127.42,62.03 BMS_MODE.3
WHEEL0
  Top 0.61: 88.42,41.27 88.42,38.8 85.81,36.19 U$2.4 84.72,36.19 84.72,34 86.02,32.7 93.22,32.7 96.02,29.9 96.02,10.5 89.82,4.3 89.52,4 88.62,3.1 15.82,3.1 3.72,15.2 3.72,23.4 2.48,24.64 U$17.A2 | 88.42,41.27 88.42,45.27 R7.2 | U$2.7 88.42,41.27
WHEEL1
  Top 0.61: 65.32,41.5 65.32,38.7 62.81,36.19 U$3.4 59.81,33.59 53.52,27.3 53.52,11.1 49.32,6.9 17.32,6.9 7.72,16.5 7.72,23.9 5.72,25.9 3.72,25.9 2.48,27.14 U$17.A4 | 65.32,41.5 65.32,44.97 R10.2 | U$3.7 65.55,41.27 65.32,41.5
WHEEL2
  Top 0.61: 65.52,23.8 65.52,20.4 63.81,18.69 U$4.4 59.81,9.89 56.12,6.2 55.72,5.8 55.62,5.7 16.82,5.7 6.42,16.1 6.42,23.3 5.06,24.66 U$17.A3 | 65.52,23.8 65.52,27.67 R12.2 | U$4.7 65.55,23.77 65.52,23.8
WHEEL3
  Top 0.61: 88.32,23.77 88.32,20.3 86.71,18.69 U$5.4 84.82,18.69 84.82,6.2 83.02,4.4 16.32,4.4 5.02,15.7 U$17.A1 | 88.32,23.77 88.32,28.27 R14.2 | U$5.7 88.32,23.77

### Text on the board
tNames: PUMP | RTDS | SEVCON | FANS | LAP TX | AIRS | BRAKE | IMD | DAQ | BMS | TUFTS RACING | GLV MOTHERBOARD V2.0.2 | APR 2017 | NOEL HWANG | ZACHARY FABER MANNING